# EAGLE design Oven Control (EAGLE 9.3.0)
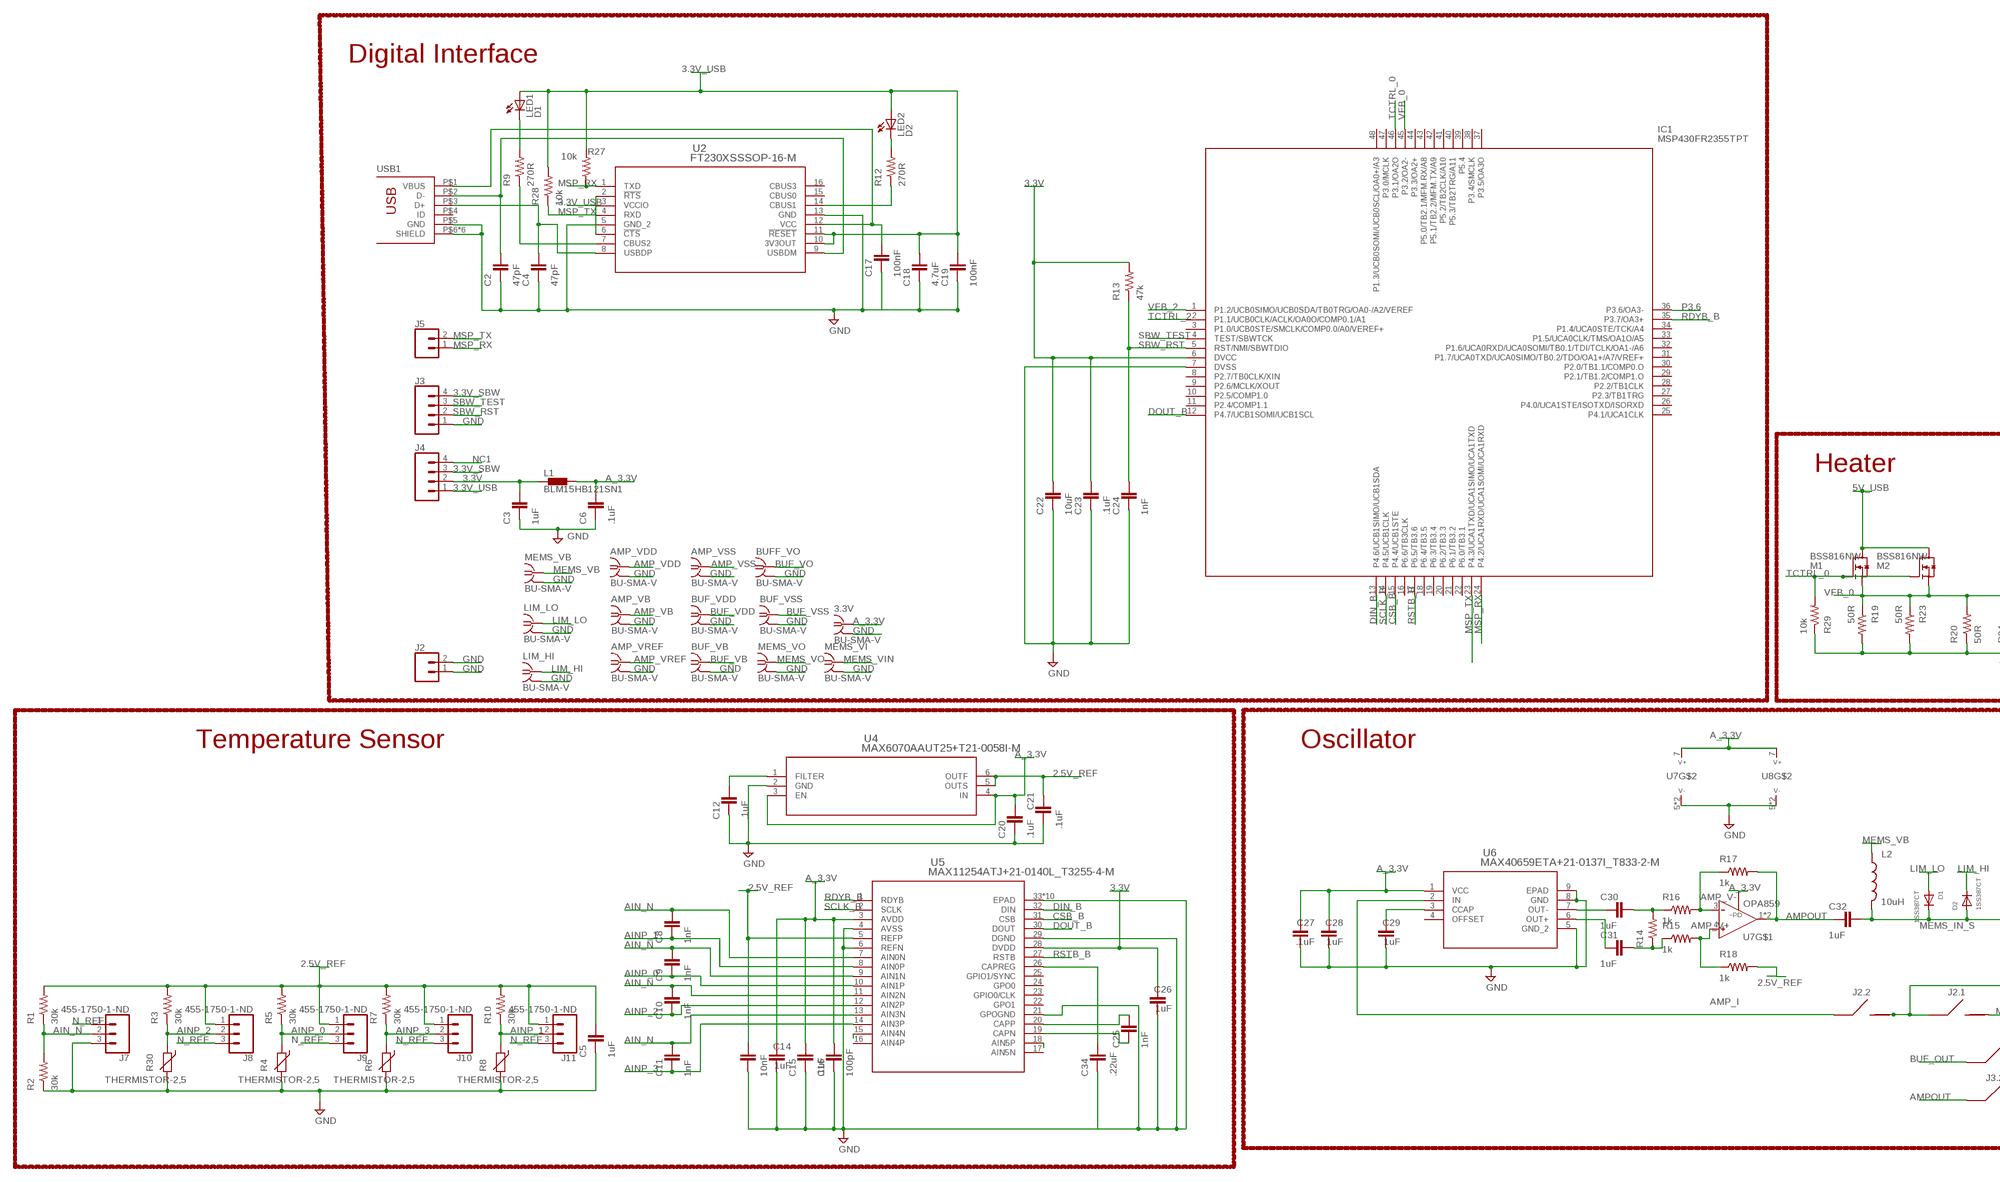
[diagram p0: schematic, sheet 1, part 1 of 2]
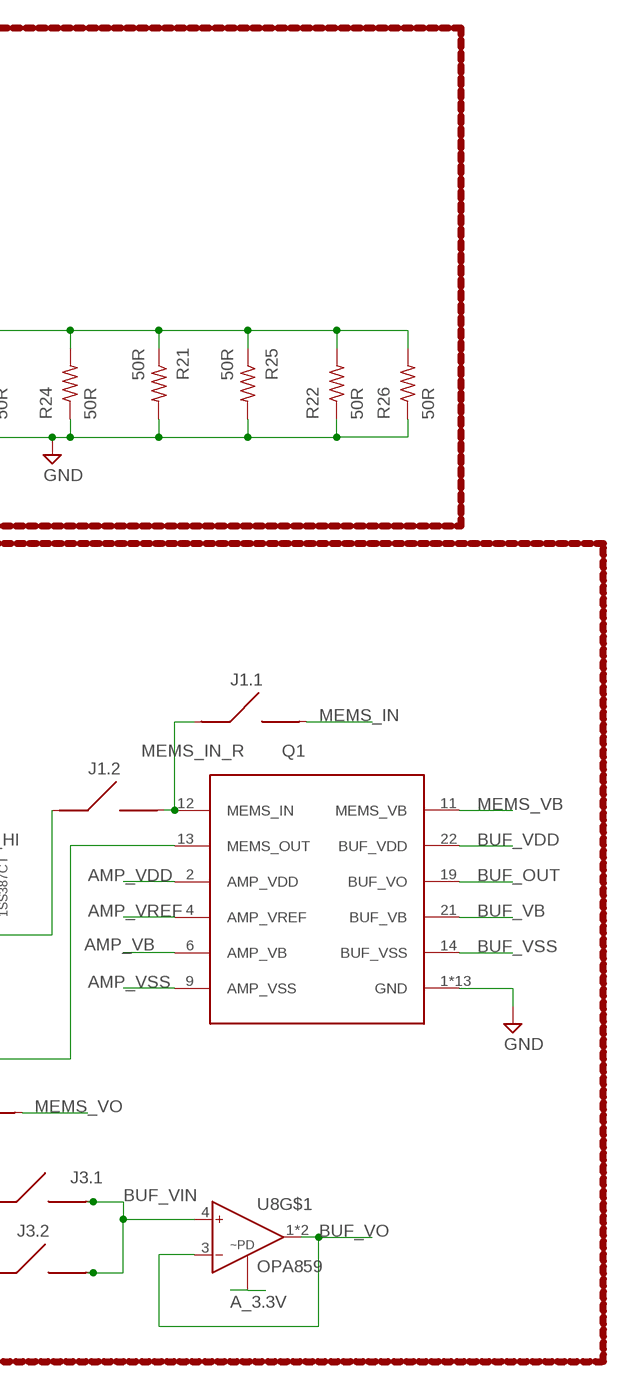
[diagram p1: schematic, sheet 1, part 2 of 2]

## Parts
3.3V  BU-SMA-V  [BU-SMA-V]
AMP_VB  BU-SMA-V  [BU-SMA-V]
AMP_VDD  BU-SMA-V  [BU-SMA-V]
AMP_VREF  BU-SMA-V  [BU-SMA-V]
AMP_VSS  BU-SMA-V  [BU-SMA-V]
BUF_VB  BU-SMA-V  [BU-SMA-V]
BUF_VDD  BU-SMA-V  [BU-SMA-V]
BUF_VSS  BU-SMA-V  [BU-SMA-V]
BUFF_VO  BU-SMA-V  [BU-SMA-V]
C2  47pF  CAP0402-CAP  [0402-CAP]
C3  1uF  CAP0402-CAP  [0402-CAP]
C4  47pF  CAP0402-CAP  [0402-CAP]
C5  1uF  CAP0402-CAP  [0402-CAP]
C6  .1uF  CAP0402-CAP  [0402-CAP]
C8  1nF  CAP0402-CAP  [0402-CAP]
C9  1nF  CAP0402-CAP  [0402-CAP]
C10  1nF  CAP0402-CAP  [0402-CAP]
C11  1nF  CAP0402-CAP  [0402-CAP]
C12  .1uF  CAP0402-CAP  [0402-CAP]
C13  10nF  CAP0402-CAP  [0402-CAP]
C14  1uF  CAP0402-CAP  [0402-CAP]
C15  .1uF  CAP0402-CAP  [0402-CAP]
C16  100pF  CAP0402-CAP  [0402-CAP]
C17  100nF  CAP0402-CAP  [0402-CAP]
C18  4.7uF  CAP0402-CAP  [0402-CAP]
C19  100nF  CAP0402-CAP  [0402-CAP]
C20  .1uF  CAP0402-CAP  [0402-CAP]
C21  .1uF  CAP0402-CAP  [0402-CAP]
C22  10uF  CAP0603-CAP  [0603-CAP]
C23  .1uF  CAP0402-CAP  [0402-CAP]
C24  1nF  CAP0402-CAP  [0402-CAP]
C25  1nF  CAP0402-CAP  [0402-CAP]
C26  1uF  CAP0402-CAP  [0402-CAP]
C27  .1uF  CAP0402-CAP  [0402-CAP]
C28  1uF  CAP0402-CAP  [0402-CAP]
C29  1uF  CAP0402-CAP  [0402-CAP]
C30  1uF  CAP0402-CAP  [0402-CAP]
C31  1uF  CAP0402-CAP  [0402-CAP]
C32  1uF  CAP0402-CAP  [0402-CAP]
C34  .22uF  CAP0402-CAP  [0402-CAP]
D1  1SS387CT  [SOD-882]
D2  1SS387CT  [SOD-882]
IC1  MSP430FR2355TPT  [QFP50P900X900X145-48N]
J1.1  0OHM_R  [R0402]
J1.2  0OHM_R  [R0402]
J2  CONN_02  [1X02]
J2.1  0OHM_R  [R0402]
J2.2  0OHM_R  [R0402]
J3  CONN_04  [1X04]
J3.1  0OHM_R  [R0402]
J3.2  0OHM_R  [R0402]
J4  CONN_04  [1X04]
J5  CONN_02  [1X02]
J7  455-1750-1-ND  CONN_03  [1X03]
J8  455-1750-1-ND  CONN_03  [1X03]
J9  455-1750-1-ND  CONN_03  [1X03]
J10  455-1750-1-ND  CONN_03  [1X03]
J11  455-1750-1-ND  CONN_03  [1X03]
L1  BLM15HB121SN1  [0402]
L2  10uH  INDUCTOR_0805  [R0805]
LED1  D1  LEDCHIPLED_0603  [CHIPLED_0603]
LED2  D2  LEDCHIPLED_0603  [CHIPLED_0603]
LIM_HI  BU-SMA-V  [BU-SMA-V]
LIM_LO  BU-SMA-V  [BU-SMA-V]
M1  BSS816NW  [SOT-323]
M2  BSS816NW  [SOT-323]
MEMS_VB  BU-SMA-V  [BU-SMA-V]
MEMS_VI  BU-SMA-V  [BU-SMA-V]
MEMS_VO  BU-SMA-V  [BU-SMA-V]
Q1  MEMS_RESONATOR  [DIL24]
R1  30k  R-US_R0603  [R0603]
R2  30k  R-US_R0603  [R0603]
R3  30k  R-US_R0603  [R0603]
R4  THERMISTOR-2,5  [RS-2,5]
R5  30k  R-US_R0603  [R0603]
R6  THERMISTOR-2,5  [RS-2,5]
R7  30k  R-US_R0603  [R0603]
R8  THERMISTOR-2,5  [RS-2,5]
R9  270R  R-US_R0603  [R0603]
R10  30k  R-US_R0603  [R0603]
R12  270R  R-US_R0603  [R0603]
R13  47k  R-US_R0603  [R0603]
R14  150R  R-US_R0402  [R0402]
R15  1k  R-US_R0402  [R0402]
R16  1k  R-US_R0402  [R0402]
R17  1k  R-US_R0402  [R0402]
R18  1k  R-US_R0402  [R0402]
R19  50R  R-US_R1206  [R1206]
R20  50R  R-US_R1206  [R1206]
R21  50R  R-US_R1206  [R1206]
R22  50R  R-US_R1206  [R1206]
R23  50R  R-US_R1206  [R1206]
R24  50R  R-US_R1206  [R1206]
R25  50R  R-US_R1206  [R1206]
R26  50R  R-US_R1206  [R1206]
R27  10k  R-US_R0402  [R0402]
R28  10k  R-US_R0402  [R0402]
R29  10k  R-US_R0402  [R0402]
R30  THERMISTOR-2,5  [RS-2,5]
U2  FT230XSSSOP-16-M  [SSOP-16-M]
U4  MAX6070AAUT25+T21-0058I-M  [21-0058I-M]
U5  MAX11254ATJ+21-0140L_T3255-4-M  [21-0140L_T3255-4-M]
U6  MAX40659ETA+21-0137I_T833-2-M  [21-0137I_T833-2-M]
U7  OPA859  [SON50P200X200X80-9N]
U8  OPA859  [SON50P200X200X80-9N]
USB1  USB-OTGMICRO-AB  [USB-MICRO-AB]

## Nets
2.5V_REF: C5.2 C13.2 C21.2 J8.1 J9.1 J10.1 J11.1 R1.2 R3.2 R5.2 R7.2 R10.2 R18.2 U4.5(OUTS) U4.6(OUTF) U5.5(REFP)
3.3V: C3.2 C22.2 C23.2 C26.2 IC1.6(DVCC) J4.2 L1.1 R13.2 U5.28(DVDD)
3.3V_SBW: J3.4 J4.3
3.3V_USB: C18.2 C19.2 J4.1 LED1.A LED2.A R27.2 R28.2 U2.3(VCCIO) U2.10(3V3OUT) U2.11(!RESET)
5V_USB: C17.2 M1.D M2.D U2.12(VCC) USB1.P$1(VBUS)
A_3.3V: 3.3V.1 C6.2 C14.2 C15.2 C16.2 C20.2 C27.2 C28.2 L1.2 U4.3(EN) U4.4(IN) U5.3(AVDD) U6.1(VCC) U7.7(V+) U7.8 U8.7(V+) U8.8
AIN_N: C8.2 C9.2 C10.2 C11.2 J7.2 R1.1 R2.2 U5.7(AIN0N) U5.9(AIN1N) U5.11(AIN2N) U5.13(AIN3N)
AINP_0: C9.1 J9.2 R4.1 R5.1 U5.10(AIN1P)
AINP_1: C8.1 J11.2 R8.1 R10.1 U5.8(AIN0P)
AINP_2: C10.1 J8.2 R3.1 R30.1 U5.12(AIN2P)
AINP_3: C11.1 J10.2 R6.1 R7.1 U5.14(AIN3P)
AMP_I: J2.2.1 U6.2(IN)
AMP_V+: R15.2 R18.1 U7.4(IN+)
AMP_V-: R16.2 R17.1 U7.3(IN-)
AMP_VB: AMP_VB.1 Q1.6(AMP_VB)
AMP_VDD: AMP_VDD.1 Q1.2(AMP_VDD)
AMP_VREF: AMP_VREF.1 Q1.4(AMP_VREF)
AMP_VSS: AMP_VSS.1 Q1.9(AMP_VSS)
AMPOUT: C32.1 J3.2.1 R17.2 U7.1(OUT) U7.6(OUT)
BUF_OUT: J3.1.1 Q1.19(BUF_VO)
BUF_VB: BUF_VB.1 Q1.21(BUF_VB)
BUF_VDD: BUF_VDD.1 Q1.22(BUF_VDD)
BUF_VIN: J3.1.2 J3.2.2 U8.4(IN+)
BUF_VO: BUFF_VO.1 U8.1(OUT) U8.3(IN-) U8.6(OUT)
BUF_VSS: BUF_VSS.1 Q1.14(BUF_VSS)
CSB_B: IC1.15(P4.4/UCB1STE) U5.31(CSB)
D+: C4.2 U2.8(USBDP) USB1.P$3(D+)
D-: C2.2 U2.9(USBDM) USB1.P$2(D-)
DIN_B: IC1.13(P4.6/UCB1SIMO/UCB1SDA) U5.32(DIN)
DOUT_B: IC1.12(P4.7/UCB1SOMI/UCB1SCL) U5.30(DOUT)
GND: 3.3V.2 3.3V.3 3.3V.4 3.3V.5 AMP_VB.2 AMP_VB.3 AMP_VB.4 AMP_VB.5 AMP_VDD.2 AMP_VDD.3 AMP_VDD.4 AMP_VDD.5 AMP_VREF.2 AMP_VREF.3 AMP_VREF.4 AMP_VREF.5 AMP_VSS.2 AMP_VSS.3 AMP_VSS.4 AMP_VSS.5 BUF_VB.2 BUF_VB.3 BUF_VB.4 BUF_VB.5 BUF_VDD.2 BUF_VDD.3 BUF_VDD.4 BUF_VDD.5 BUF_VSS.2 BUF_VSS.3 BUF_VSS.4 BUF_VSS.5 BUFF_VO.2 BUFF_VO.3 BUFF_VO.4 BUFF_VO.5 C2.1 C3.1 C4.1 C5.1 C6.1 C12.1 C13.1 C14.1 C15.1 C16.1 C17.1 C18.1 C19.1 C20.1 C21.1 C22.1 C23.1 C24.1 C26.1 C27.1 C28.1 C29.1 C34.1 IC1.7(DVSS) J2.1 J2.2 J3.1 J7.3 LIM_HI.2 LIM_HI.3 LIM_HI.4 LIM_HI.5 LIM_LO.2 LIM_LO.3 LIM_LO.4 LIM_LO.5 MEMS_VB.2 MEMS_VB.3 MEMS_VB.4 MEMS_VB.5 MEMS_VI.2 MEMS_VI.3 MEMS_VI.4 MEMS_VI.5 MEMS_VO.2 MEMS_VO.3 MEMS_VO.4 MEMS_VO.5 Q1.1(GND) Q1.3(GND) Q1.5(GND) Q1.7(GND) Q1.8(GND) Q1.10(GND) Q1.15(GND) Q1.16(GND) Q1.17(GND) Q1.18(GND) Q1.20(GND) Q1.23(GND) Q1.24(GND) R2.1 R4.2 R6.2 R8.2 R19.2 R20.1 R21.2 R22.1 R23.2 R24.1 R25.2 R26.1 R29.1 R30.2 U2.5(GND_2) U2.13(GND) U4.2(GND) U5.4(AVSS) U5.6(REFN) U5.21(GPOGND) U5.29(DGND) U5.33(EPAD) U5.P$1(EPAD) U5.P$2(EPAD) U5.P$3(EPAD) U5.P$4(EPAD) U5.P$5(EPAD) U5.P$6(EPAD) U5.P$7(EPAD) U5.P$8(EPAD) U5.P$9(EPAD) U6.5(GND_2) U6.8(GND) U6.9(EPAD) U7.5(V-) U7.9(V-) U8.5(V-) U8.9(V-) USB1.P$5(GND) USB1.P$6(SHIELD) USB1.P$7(SHIELD) USB1.P$8(SHIELD) USB1.P$9(SHIELD) USB1.P$10(SHIELD) USB1.P$11(SHIELD)
LIM_HI: D2.C LIM_HI.1
LIM_LO: D1.A LIM_LO.1
MEMS_IN: J1.1.2
MEMS_IN_R: J1.1.1 J1.2.2 Q1.12(MEMS_IN)
MEMS_IN_S: C32.2 D1.C D2.A J1.2.1 L2.2
MEMS_OUT: J2.1.1 J2.2.2 Q1.13(MEMS_OUT)
MEMS_VB: L2.1 MEMS_VB.1 Q1.11(MEMS_VB)
MEMS_VIN: MEMS_VI.1
MEMS_VO: J2.1.2 MEMS_VO.1
MSP_RX: IC1.24(P4.2/UCA1RXD/UCA1SOMI/UCA1RXD) J5.1 R27.1 U2.1(TXD)
MSP_TX: IC1.23(P4.3/UCA1TXD/UCA1SIMO/UCA1TXD) J5.2 R28.1 U2.4(RXD)
N$1: C25.2 U5.20(CAPP)
N$2: C25.1 U5.19(CAPN)
N$3: C31.2 R14.1 R15.1
N$4: C29.2 U6.3(CCAP)
N$5: U5.17(AIN5N)
N$6: C12.2 U4.1(FILTER)
N$7: C30.2 R14.2 R16.1
N$8: U5.16(AIN4P)
N$10: C34.2 U5.26(CAPREG)
N$12: C30.1 U6.7(OUT-)
N$13: C31.1 U6.6(OUT+)
N$15: U2.2(!RTS) U2.6(!CTS)
N$20: LED2.C R12.2
N$21: LED1.C R9.2
N$34: U5.18(AIN5P)
N$35: U5.15(AIN4N)
N_REF: J7.1 J8.3 J9.3 J10.3 J11.3
NC1: J4.4
P3.6: IC1.36(P3.6/OA3-)
RDYB_B: IC1.35(P3.7/OA3+) U5.1(RDYB)
RSTB_B: IC1.17(P6.5/TB3.6) U5.27(RSTB)
RX#1: R12.1 U2.14(CBUS1)
SBW_RST: C24.2 IC1.5(RST/NMI/SBWTDIO) J3.2 R13.1
SBW_TEST: IC1.4(TEST/SBWTCK) J3.3
SCLK_B: IC1.14(P4.5/UCB1CLK) U5.2(SCLK)
TCTRL_0: IC1.46(P3.1/OA2O) M1.G M2.G R29.2
TCTRL_2: IC1.2(P1.1/UCB0CLK/ACLK/OA0O/COMP0.1/A1)
TX#1: R9.1 U2.7(CBUS2)
VFB_0: IC1.45(P3.2/OA2-) M1.S M2.S R19.1 R20.2 R21.1 R22.2 R23.1 R24.2 R25.1 R26.2
VFB_2: IC1.1(P1.2/UCB0SIMO/UCB0SDA/TB0TRG/OA0-/A2/VEREF)
Unconnected: IC1.3(P1.0/UCB0STE/SMCLK/COMP0.0/A0/VEREF+) IC1.8(P2.7/TB0CLK/XIN) IC1.9(P2.6/MCLK/XOUT) IC1.10(P2.5/COMP1.0) IC1.11(P2.4/COMP1.1) IC1.16(P6.6/TB3CLK) IC1.18(P6.4/TB3.5) IC1.19(P6.3/TB3.4) IC1.20(P6.2/TB3.3) IC1.21(P6.1/TB3.2) IC1.22(P6.0/TB3.1) IC1.25(P4.1/UCA1CLK) IC1.26(P4.0/UCA1STE/ISOTXD/ISORXD) IC1.27(P2.3/TB1TRG) IC1.28(P2.2/TB1CLK) IC1.29(P2.1/TB1.2/COMP1.O) IC1.30(P2.0/TB1.1/COMP0.O) IC1.31(P1.7/UCA0TXD/UCA0SIMO/TB0.2/TDO/OA1+/A7/VREF+) IC1.32(P1.6/UCA0RXD/UCA0SOMI/TB0.1/TDI/TCLK/OA1-/A6) IC1.33(P1.5/UCA0CLK/TMS/OA1O/A5) IC1.34(P1.4/UCA0STE/TCK/A4) IC1.37(P3.5/OA3O) IC1.38(P3.4/SMCLK) IC1.39(P5.4) IC1.40(P5.3/TB2TRG/A11) IC1.41(P5.2/TB2CLK/A10) IC1.42(P5.1/TB2.2/MFM.TX/A9) IC1.43(P5.0/TB2.1/MFM.RX/A8) IC1.44(P3.3/OA2+) IC1.47(P3.0/MCLK) IC1.48(P1.3/UCB0SOMI/UCB0SCL/OA0+/A3) U2.15(CBUS0) U2.16(CBUS3) U5.22(GPO1) U5.23(GPIO0/CLK) U5.24(GPO0) U5.25(GPIO1/SYNC) U6.4(OFFSET) USB1.P$4(ID)

## Notes on the sheet
- Digital Interface
- Heater
- Temperature Sensor | Oscillator

## Library data of the parts
3.3V AMP_VB AMP_VDD AMP_VREF AMP_VSS BUF_VB BUF_VDD BUF_VSS BUFF_VO LIM_HI LIM_LO MEMS_VB MEMS_VI MEMS_VO = con-coax:BU-SMA-V: FEMALE SMA CONNECTOR Radiall distributor RS 112-3794; OC_FARNELL: unknown; OC_NEWARK: unknown
C2-C6 C8-C32 C34 = pie:CAP: Capacitor Standard 0603 ceramic capacitor, and 0.1" leaded capacitor.; PIE-INT-REF-NUM: CAPACITOR-GENERIC
D1 D2 = Oven Control Lib:1SS387CT; PART_NO: 1SS387CT
IC1 = Oven Control Lib:MSP430FR2355TPT: 16-bit Microcontrollers - MCU 24MHz 105C ULP Microcontroller With 32 KB FRAM, 4 KB SRAM, 44 IO, 12-bit ADC, 12-bit DACs, OpAmp/PGA 48-LQFP -40 to 105 Source: Datasheet <https://www.arrow.com/en/products/msp430fr2355tpt/texas-instruments>; DESCRIPTION: 16-bit Microcontrollers - MCU 24MHz 105C ULP Microcontroller With 32 KB FRAM, 4 KB SRAM, 44 IO, 12-bit ADC, 12-bit DACs, OpAmp/PGA 48-LQFP -40 to 105; HEIGHT: 1.45mm; MANUFACTURER_NAME: Texas Instruments; MANUFACTURER_PART_NUMBER: MSP430FR2355TPT
J1.1 J1.2 J2.1 J2.2 J3.1 J3.2 = Oven Control Lib:0OHM_R
J2 J5 = SparkFun-Connectors:CONN_02: Multi connection point. Often used as Generic Header-pin footprint for 0.1 inch spaced/style header connections On any of the 0.1 inch spaced packages, you can populate with these: Break Away Headers - Straight <https://www.sparkfun.com/products/116> (PRT-00116) Break Away Male Headers - Right Angle <https://www.sparkfun.com/products/553> (PRT-00553) Female Headers <https://www.sparkfun.com/products/115> (PRT-00115) Break Away Headers - Machine Pin <https://www.sparkfun.com/products/117> (PRT-00117) Break Away Female Headers - Swiss Machine Pin <https://www.sparkfun.com/products/743> (PRT-00743) For SCREWTERMINALS and SPRING TERMINALS visit here: Screw Terimnals on SparkFun.com <https://www.sparkfun.com/search/results?term=Screw+Terminals> (5mm/3.5mm/2.54mm spacing) This device is also useful as a general connection point to wire up your design to another part of your project. Our various solder wires solder well into these plated through hole pads. Hook-Up Wire - Assortment (Stranded, 22 AWG) <https://www.sparkfun.com/products/11375> (PRT-11375) Hook-Up Wire - Assortment (Solid Core, 22 AWG) <https://www.sparkfun.com/products/11367> (PRT-11367) View the entire wire category on our website here <https://www.sparkfun.com/categories/141> Special notes: Molex polarized connector foot print use with: PRT-08233 with associated crimp pins and housings. 2.54_SCREWTERM for use with PRT-10571. 3.5mm Screw Terminal footprints for PRT-08084 5mm Screw Terminal footprints for use with PRT-08432
J3 J4 = SparkFun-Connectors:CONN_04: Multi connection point. Often used as Generic Header-pin footprint for 0.1 inch spaced/style header connections On any of the 0.1 inch spaced packages, you can populate with these: Break Away Headers - Straight <https://www.sparkfun.com/products/116> (PRT-00116) Break Away Male Headers - Right Angle <https://www.sparkfun.com/products/553> (PRT-00553) Female Headers <https://www.sparkfun.com/products/115> (PRT-00115) Break Away Headers - Machine Pin <https://www.sparkfun.com/products/117> (PRT-00117) Break Away Female Headers - Swiss Machine Pin <https://www.sparkfun.com/products/743> (PRT-00743) For SCREWTERMINALS and SPRING TERMINALS visit here: Screw Terimnals on SparkFun.com <https://www.sparkfun.com/search/results?term=Screw+Terminals> (5mm/3.5mm/2.54mm spacing) This device is also useful as a general connection point to wire up your design to another part of your project. Our various solder wires solder well into these plated through hole pads. Hook-Up Wire - Assortment (Stranded, 22 AWG) <https://www.sparkfun.com/products/11375> (PRT-11375) Hook-Up Wire - Assortment (Solid Core, 22 AWG) <https://www.sparkfun.com/products/11367> (PRT-11367) View the entire wire category on our website here <https://www.sparkfun.com/categories/141> Special notes: Molex polarized connector foot print use with SKU : PRT-08231 with associated crimp pins and housings. 1MM SMD Version SKU: PRT-10208; PROD_ID: CONN-09696
J7-J11 = SparkFun-Connectors:CONN_03: Multi connection point. Often used as Generic Header-pin footprint for 0.1 inch spaced/style header connections On any of the 0.1 inch spaced packages, you can populate with these: Break Away Headers - Straight <https://www.sparkfun.com/products/116> (PRT-00116) Break Away Male Headers - Right Angle <https://www.sparkfun.com/products/553> (PRT-00553) Female Headers <https://www.sparkfun.com/products/115> (PRT-00115) Break Away Headers - Machine Pin <https://www.sparkfun.com/products/117> (PRT-00117) Break Away Female Headers - Swiss Machine Pin <https://www.sparkfun.com/products/743> (PRT-00743) Stackable Header - 3 Pin (Female, 0.1") <https://www.sparkfun.com/products/13875> (PRT-13875) For SCREWTERMINALS and SPRING TERMINALS visit here: Screw Terimnals on SparkFun.com <https://www.sparkfun.com/search/results?term=Screw+Terminals> (5mm/3.5mm/2.54mm spacing) This device is also useful as a general connection point to wire up your design to another part of your project. Our various solder wires solder well into these plated through hole pads. Hook-Up Wire - Assortment (Stranded, 22 AWG) <https://www.sparkfun.com/products/11375> (PRT-11375) Hook-Up Wire - Assortment (Solid Core, 22 AWG) <https://www.sparkfun.com/products/11367> (PRT-11367) View the entire wire category on our website here <https://www.sparkfun.com/categories/141> Special notes: Molex polarized connector foot print use with SKU : PRT-08232 with associated crimp pins and housings.; PROD_ID: XXX-00000
L1 = inductors:BLM15H: EMIFIL (R) Chip Ferrite Bead for GHz Noise Source: http://www.murata.com/ Ferrite Bead BLM15H.pdf
L2 = Oven Control Lib:INDUCTOR_0805
LED1 LED2 = adafruit:LED: LED OSRAM: - CHIPLED LG R971, LG N971, LY N971, LG Q971, LY Q971, LO R971, LY R971 LH N974, LH R974 LS Q976, LO Q976, LY Q976 LO Q996 - Hyper CHIPLED LW Q18S LB Q993, LB Q99A, LB R99A - SideLED LS A670, LO A670, LY A670, LG A670, LP A670 LB A673, LV A673, LT A673, LW A673 LH A674 LY A675 LS A676, LA A676, LO A676, LY A676, LW A676 LS A679, LY A679, LG A679 - Hyper Micro SIDELED® LS Y876, LA Y876, LO Y876, LY Y876 LT Y87S - SmartLED LW L88C, LW L88S LB L89C, LB L89S, LG L890 LS L89K, LO L89K, LY L89K LS L896, LA L896, LO L896, LY L896 - TOPLED LS T670, LO T670, LY T670, LG T670, LP T670 LSG T670, LSP T670, LSY T670, LOP T670, LYG T670 LG T671, LOG T671, LSG T671 LB T673, LV T673, LT T673, LW T673 LH T674 LS T676, LA T676, LO T676, LY T676, LB T676, LH T676, LSB T676, LW T676 LB T67C, LV T67C, LT T67C, LS T67K, LO T67K, LY T67K, LW E67C LS E67B, LA E67B, LO E67B, LY E67B, LB E67C, LV E67C, LT E67C LW T67C LS T679, LY T679, LG T679 LS T770, LO T770, LY T770, LG T770, LP T770 LB T773, LV T773, LT T773, LW T773 LH T774 LS E675, LA E675, LY E675, LS T675 LS T776, LA T776, LO T776, LY T776, LB T776 LHGB T686 LT T68C, LB T68C - Hyper Mini TOPLED® LB M676 - Mini TOPLED Santana® LG M470 LS M47K, LO M47K, LY M47K Source: http://www.osram.convergy.de/
M1 M2 = Oven Control Lib:BSS816NW
Q1 = Oven Control Lib:MEMS_RESONATOR
R1-R3 R5 R7 R9 R10 R12 R13 = pie:R-US_: RESISTOR, American symbol; DESCRIPTION: RESISTOR, American symbol; DISTRIBUTOR: DigiKey; MANUFACTURER: Rohm Semiconductor; NOTES: Cut Tape; PACKAGE: R0603; VALUE: >VALUE
R4 R6 R8 R30 = varistor:THERMISTOR: THERMISTOR; PART_NO: NXRT15WB473FA1B030
R14-R29 = pie:R-US_: RESISTOR, American symbol; PIE-INT-REF-NUM: RESISTOR-GENERIC
U2 = Oven Control Lib:FT230XS; MANUFACTURER_PART_NUMBER: FT230XS; VENDOR: FTDI Future Technology Devices International Ltd
U4 = Oven Control Lib:MAX6070AAUT25+T; MANUFACTURER_PART_NUMBER: MAX6070AAUT25+T; VENDOR: Maxim Integrated Products
U5 = Oven Control Lib:MAX11254ATJ+; MANUFACTURER_PART_NUMBER: MAX11254ATJ+; VENDOR: Maxim Integrated Products
U6 = Oven Control Lib:MAX40659ETA+; MANUFACTURER_PART_NUMBER: MAX40659ETA+; VENDOR: Maxim Integrated Products
U7 = Oven Control Lib:OPA859; SPICEPREFIX: E
U8 = Oven Control Lib:OPA859
USB1 = pie:USB-OTG: USB Connector OTG connector with ID pin; PIE-DIGIKEY-PN-PRI: H11635CT-ND; PIE-INT-REF-NUM: USB

## Board
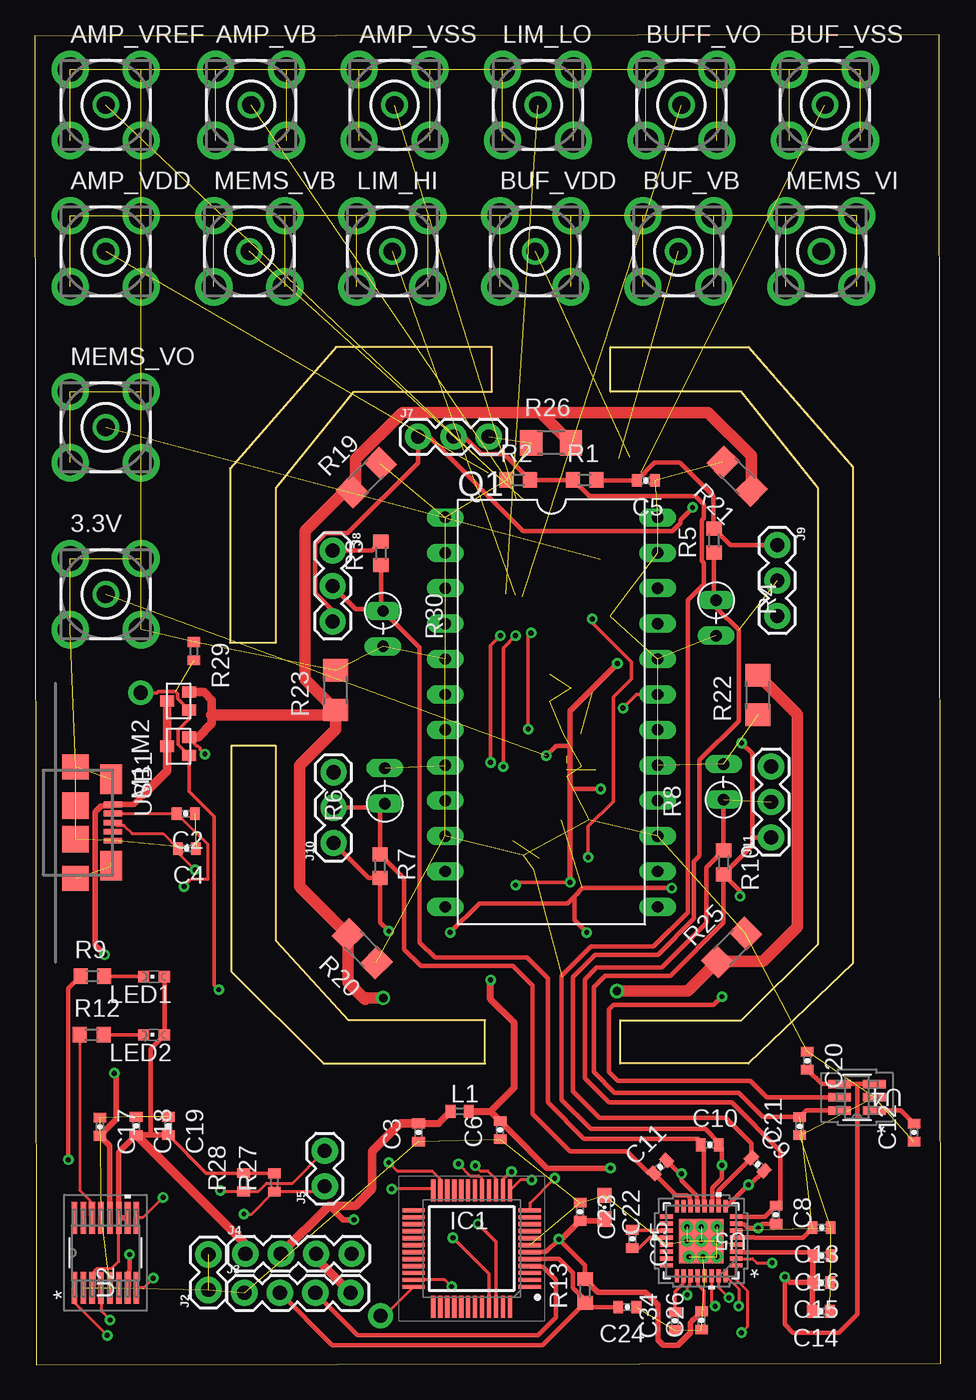
[diagram p2: board, top side]
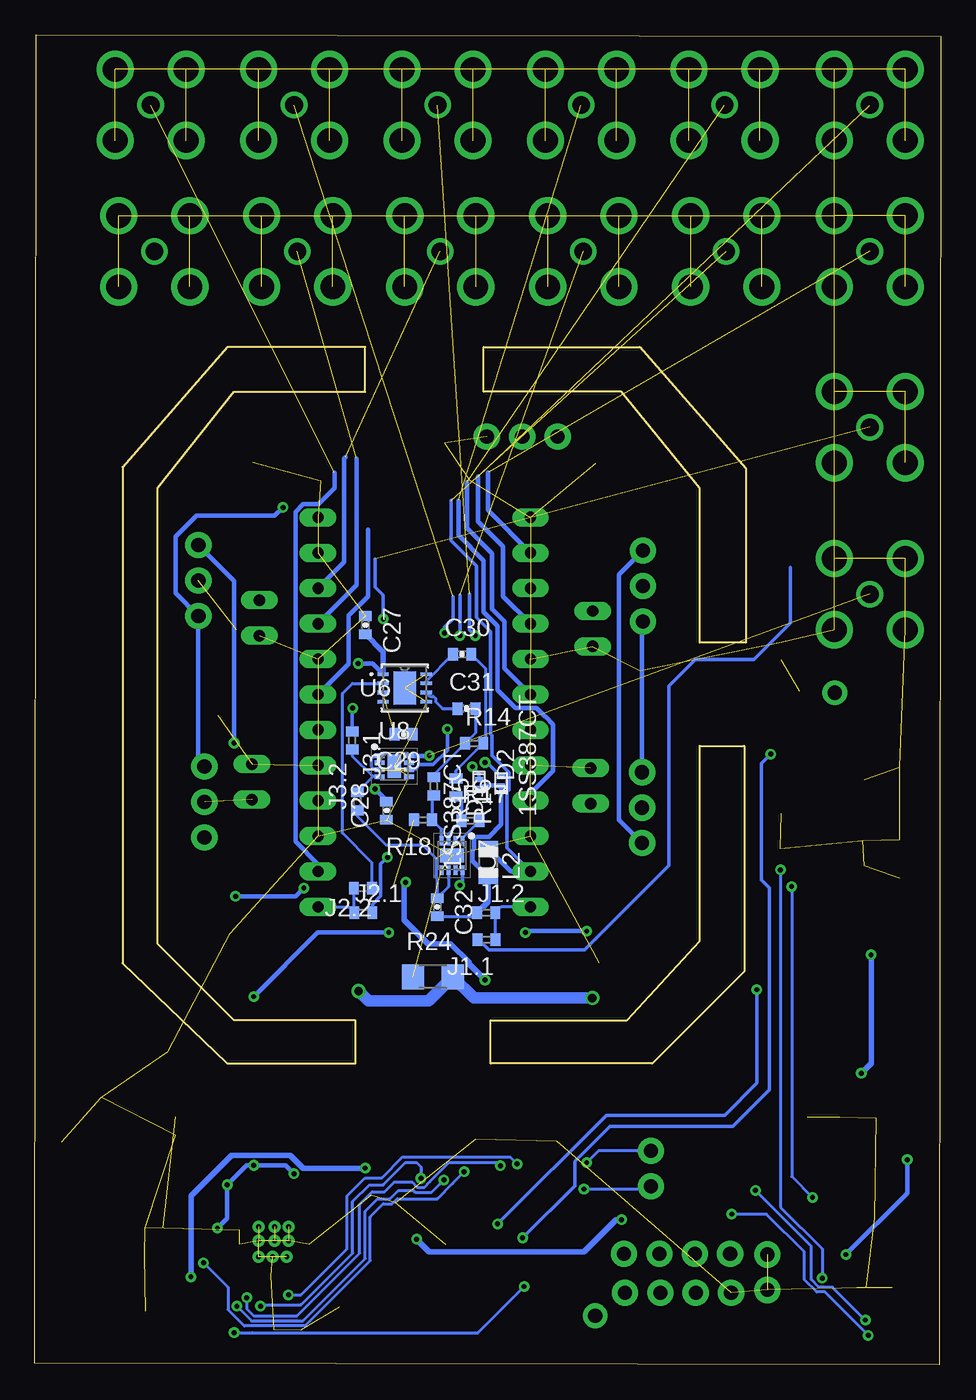
[diagram p3: board, bottom side, seen from below]

Size 65 x 95.4 mm. Coordinates in mm from the lower left corner, seen from the top.
Outline: 0.1,0 65,0.1 64.9,95.4 0,95.3 0.1,0
Outline: 20.7,21.6 32.3,21.6 32.3,24.7 22.5,24.7 17.3,30.4 17.3,44.4 14.1,44.4 14.1,28.2 20.7,21.6
Outline: 17.3,62.9 22.9,69.8 32.8,69.8 32.8,73 21.6,73 14,64.3 14,51.8 17.3,51.8 17.3,62.9
Outline: 51.2,21.6 42,21.6 42,24.7 50.7,24.7 56.2,30.2 56.2,62.9 50.7,69.8 41.3,69.8 41.3,73 51.2,73 58.7,64.4 58.7,28.8 51.2,21.6
Copper layers (1*16): Top 0.035mm / dielectric 1.5mm / Bottom 0.035mm
Design rules "default": minimum track width 6mil, minimum drill 0.35mm, track to track 6mil, track to pad 6mil, pad to pad 6mil, via to via 6mil, smd to smd 6mil, copper to edge 40mil, drill to drill 6mil, minimum pad ring 10mil, minimum via ring 8mil, stop-mask expansion 4mil, vias tented up to drill 0mil, thermal gap 10mil

### Footprints (pad centres in the part's own frame; a part is rotated, then mirrored left to right if it is on the bottom)
BU-SMA-V = drill 1.27: 1 0,0 | drill 1.778: 2 -2.55,2.55; 3 2.55,2.55; 4 2.55,-2.55; 5 -2.55,-2.55
0402-CAP = smd 0.7 x 0.9: 1 -0.65,0; 2 0.65,0
0603-CAP = smd 1.1 x 1: 1 -0.85,0; 2 0.85,0
SOD-882 = smd 0.35 x 0.6: A 0.325,0; C -0.325,0
QFP50P900X900X145-48N = smd 1.6 x 0.3: 1 -4.175,2.75; 2 -4.175,2.25; 3 -4.175,1.75; 4 -4.175,1.25; 5 -4.175,0.75; 6 -4.175,0.25; 7 -4.175,-0.25; 8 -4.175,-0.75; 9 -4.175,-1.25; 10 -4.175,-1.75; 11 -4.175,-2.25; 12 -4.175,-2.75; 25 4.175,-2.75; 26 4.175,-2.25; 27 4.175,-1.75; 28 4.175,-1.25; 29 4.175,-0.75; 30 4.175,-0.25; 31 4.175,0.25; 32 4.175,0.75; 33 4.175,1.25; 34 4.175,1.75; 35 4.175,2.25; 36 4.175,2.75 | smd 0.3 x 1.6: 13 -2.75,-4.175; 14 -2.25,-4.175; 15 -1.75,-4.175; 16 -1.25,-4.175; 17 -0.75,-4.175; 18 -0.25,-4.175; 19 0.25,-4.175; 20 0.75,-4.175; 21 1.25,-4.175; 22 1.75,-4.175; 23 2.25,-4.175; 24 2.75,-4.175; 37 2.75,4.175; 38 2.25,4.175; 39 1.75,4.175; 40 1.25,4.175; 41 0.75,4.175; 42 0.25,4.175; 43 -0.25,4.175; 44 -0.75,4.175; 45 -1.25,4.175; 46 -1.75,4.175; 47 -2.25,4.175; 48 -2.75,4.175
R0402 = smd 0.7 x 0.9: 1 -0.65,0; 2 0.65,0
1X02 = drill 1.016 pad 1.88: 1 0,0; 2 2.54,0
1X04 = drill 1.016 pad 1.88: 1 0,0; 2 2.54,0; 3 5.08,0; 4 7.62,0
1X03 = drill 1.016 pad 1.88: 1 0,0; 2 2.54,0; 3 5.08,0
0402 = smd 0.7 x 0.9: 1 -0.65,0; 2 0.65,0
R0805 = smd 1.1 x 1.4: 1 -1,0; 2 1,0
CHIPLED_0603 = smd 0.8 x 0.8: A 0,-0.75; C 0,0.75
SOT-323 = smd 0.8 x 1: D 0,0; G -0.65,-1.6; S 0.65,-1.6
DIL24 = drill 0.813 long: 1 -13.97,-7.62; 2 -11.43,-7.62; 3 -8.89,-7.62; 4 -6.35,-7.62; 5 -3.81,-7.62; 6 -1.27,-7.62; 7 1.27,-7.62; 8 3.81,-7.62; 9 6.35,-7.62; 10 8.89,-7.62; 11 11.43,-7.62; 12 13.97,-7.62; 13 13.97,7.62; 14 11.43,7.62; 15 8.89,7.62; 16 6.35,7.62; 17 3.81,7.62; 18 1.27,7.62; 19 -1.27,7.62; 20 -3.81,7.62; 21 -6.35,7.62; 22 -8.89,7.62; 23 -11.43,7.62; 24 -13.97,7.62
R0603 = smd 1 x 1.1: 1 -0.85,0; 2 0.85,0
RS-2,5 = drill 0.813 long: 1 -1.27,0; 2 1.27,0
R1206 = smd 1.6 x 1.803: 1 -1.422,0; 2 1.422,0
SSOP-16-M = smd 2.286 x 0.406: 1 -2.515,2.223; 2 -2.515,1.587; 3 -2.515,0.953; 4 -2.515,0.318; 5 -2.515,-0.318; 6 -2.515,-0.953; 7 -2.515,-1.587; 8 -2.515,-2.223; 9 2.515,-2.223; 10 2.515,-1.587; 11 2.515,-0.953; 12 2.515,-0.318; 13 2.515,0.318; 14 2.515,0.953; 15 2.515,1.587; 16 2.515,2.223
21-0058I-M = smd 1.626 x 0.61: 1 -1.245,0.95; 2 -1.245,0; 3 -1.245,-0.95; 4 1.245,-0.95; 5 1.245,0; 6 1.245,0.95
21-0140L_T3255-4-M = smd 0.914 x 0.305: 1 -2.502,1.75; 2 -2.502,1.25; 3 -2.502,0.75; 4 -2.502,0.25; 5 -2.502,-0.25; 6 -2.502,-0.75; 7 -2.502,-1.25; 8 -2.502,-1.75; 17 2.502,-1.75; 18 2.502,-1.25; 19 2.502,-0.75; 20 2.502,-0.25; 21 2.502,0.25; 22 2.502,0.75; 23 2.502,1.25; 24 2.502,1.75 | smd 0.305 x 0.914: 9 -1.75,-2.502; 10 -1.25,-2.502; 11 -0.75,-2.502; 12 -0.25,-2.502; 13 0.25,-2.502; 14 0.75,-2.502; 15 1.25,-2.502; 16 1.75,-2.502; 25 1.75,2.502; 26 1.25,2.502; 27 0.75,2.502; 28 0.25,2.502; 29 -0.25,2.502; 30 -0.75,2.502; 31 -1.25,2.502; 32 -1.75,2.502 | smd 3.2 x 3.2: 33 0,0 | drill 0.35: P$1 -1.143,1.143; P$2 -0.127,1.143; P$3 0.889,1.143; P$4 0,0; P$5 1.016,0; P$6 -1.143,0; P$7 -1.143,-1.016; P$8 0,-1.016; P$9 1.016,-1.016
21-0137I_T833-2-M = smd 0.806 x 0.254: 1 -1.553,0.991; 2 -1.553,0.33; 3 -1.553,-0.33; 4 -1.553,-0.991; 5 1.553,-0.991; 6 1.553,-0.33; 7 1.553,0.33; 8 1.553,0.991 | smd 1.6 x 2.388: 9 0,0
SON50P200X200X80-9N = smd 0.7 x 0.3: 1 -1.05,0.75; 2 -1.05,0.25; 3 -1.05,-0.25; 4 -1.05,-0.75; 5 1.05,-0.75; 6 1.05,-0.25; 7 1.05,0.25; 8 1.05,0.75 | smd 1 x 1.7: 9 0,0
USB-MICRO-AB = smd 0.4 x 1.35: P$1 -1.3,1; P$2 -0.65,1; P$3 0,1; P$4 0.65,1; P$5 1.3,1 | smd 2.1 x 1.6: P$6 -3.1,0.875; P$7 3.1,0.875 | smd 1.8 x 1.9: P$8 -4,-1.675; P$9 4,-1.675 | smd 1.9 x 1.9: P$10 -1.2,-1.675; P$11 1.2,-1.675

### Placement (x,y rotation side)
3.3V  5.09,55.27 0 top
AMP_VB  15.51,90.37 0 top
AMP_VDD  5.09,79.87 0 top
AMP_VREF  5.09,90.37 0 top
AMP_VSS  25.81,90.37 0 top
BUF_VB  46.17,79.87 0 top
BUF_VDD  35.91,79.87 0 top
BUF_VSS  56.69,90.37 0 top
BUFF_VO  46.4,90.37 0 top
C2  10.83,39.53 180 top
C3  27.53,16.66 90 top
C4  10.91,37.03 180 top
C5  43.85,63.43 180 top
C6  33.38,16.83 90 top
C8  53.17,10.76 270 top
C9  51.87,14.37 315 top
C10  48.42,15.77 0 top
C11  44.87,14.19 45 top
C12  63.08,16.65 90 top
C13  56.45,9.83 180 top
C14  56.4,3.83 180 top
C15  56.43,5.88 180 top
C16  56.47,7.83 180 top
C17  4.67,17.07 270 top
C18  7.27,17.12 270 top
C19  9.57,17.12 270 top
C20  55.42,21.81 270 top
C21  54.88,17.11 90 top
C22  40.87,11.3 270 top
C23  39.12,10.97 270 top
C24  42.51,4.13 180 top
C25  42.87,9.02 270 top
C26  47.83,3.17 90 top
C27  41.28,53.05 270 bottom
C28  39.77,39.74 90 bottom
C29  38.55,45.23 180 bottom
C30  34.34,50.97 0 bottom
C31  34.03,47.07 0 bottom
C32  36.13,32.82 270 bottom
C34  45.93,3.13 90 top
D1  31.55,41.86 90 bottom
D2  33.13,41.65 270 bottom
IC1  31.34,8.33 180 top
J1.1  32.59,30.48 180 bottom
J1.2  32.62,32.42 0 bottom
J2  12.45,5.36 90 top
J2.1  41.43,32.42 0 bottom
J2.2  41.46,34.18 180 bottom
J3  15.04,5.15 0 top
J3.1  42.23,44.78 270 bottom
J3.2  41.87,40.41 90 bottom
J4  15.11,7.95 0 top
J5  20.8,12.8 90 top
J7  27.49,66.57 0 top
J8  21.37,58.4 270 top
J9  53.27,58.79 270 top
J10  21.43,37.42 90 top
J11  52.83,37.83 90 top
L1  30.48,18.17 0 top
L2  32.48,36.02 270 bottom
LED1  8.55,27.84 90 top
LED2  8.55,23.66 90 top
LIM_HI  25.65,79.87 0 top
LIM_LO  36.1,90.37 0 top
M1  9.48,44.36 90 top
M2  9.48,47.61 90 top
MEMS_VB  15.39,79.87 0 top
MEMS_VI  56.43,79.87 0 top
MEMS_VO  5.09,67.25 0 top
Q1  37.06,46.81 270 top
R1  39.46,63.47 0 top
R2  34.68,63.47 0 top
R3  24.83,58.2 90 top
R4  48.88,53.57 270 top
R5  48.73,59.12 90 top
R6  25.12,41.52 90 top
R7  24.77,35.76 270 top
R8  49.42,41.81 90 top
R9  4.13,27.87 0 top
R10  49.42,36.03 270 top
R12  4.08,23.67 0 top
R13  39.48,5.29 90 top
R14  33.48,44.57 0 bottom
R15  36.38,41.49 270 bottom
R16  34.78,41.41 270 bottom
R17  33.73,39.02 0 bottom
R18  37.15,39.08 180 bottom
R19  23.77,63.64 45 top
R20  23.49,29.83 135 top
R21  50.39,63.73 135 top
R22  51.87,48.04 90 top
R23  21.57,48.39 90 top
R24  36.44,27.83 0 bottom
R25  49.99,29.93 45 top
R26  37.04,66.13 0 top
R27  17.18,13.07 90 top
R28  14.98,13.09 90 top
R29  11.42,51.19 270 top
R30  24.98,52.8 270 top
U2  5.07,8.02 90 top
U4  58.99,19.18 180 top
U5  47.81,8.87 180 top
U6  38.46,48.55 0 bottom
U7  35.07,36.53 270 bottom
U8  39.21,42.93 0 bottom
USB1  4.6,38.89 270 top

### Tracks (layer width: path | path; a pad name or v marks a point on that pad's centre or on a via)
2.5V_REF  (via drill 0.35)  (2 unrouted)
  Top 0.305: U4.6 55.35,18.23 C21.2 52.24,17.76 50.5,19.5 41.6,19.5 40.1,21 40.1,27.1 40.9,27.9 45.6,27.9 49.42,31.72 R10.2 | R10.2 51.47,37.23 51.47,37.83 | 51.47,37.83 J11.1 | 51.47,37.83 51.47,43.83 v50.7,44.6 | J9.1 49.91,58.79 R5.2 48.7,60 48.7,62.3 46.3,64.7 44.47,64.7 C5.2 40.35,63.43 R1.2 | R10.2 50.6,34 v50.6,33.6 | v45.7,34.19 39.29,34.19 38.7,33.6 | 38.7,33.6 38.2,33.1 31.9,33.1 v29.8,31 | v25.4,31.1 24.77,31.73 R7.2 23.94,34.91 J10.1 | U4.5 52.52,19.18 51.35,20.35 41.85,20.35 41.2,21 41.2,25.5 41.5,25.8 48.7,25.8 v49.3,26.4 | v39.6,31 38.7,31.9 38.7,33.6 | J8.1 24.18,58.4 R3.2 | U5.5 51.61,9.12 51.62,9.12 55.09,9.12 C13.2
  Bottom 0.305: v50.7,44.6 50.7,56.22 J9.1 | v50.6,33.6 46.29,33.6 v45.7,34.19 | v29.8,31 29.7,31.1 v25.4,31.1 | v49.3,26.4 44.7,31 v39.6,31 | J10.1 23.1,39.09 23.1,56.67 J8.1
3.3V  (via drill 0.35)
  Top 0.254: U5.28 47.56,5.74 48,5.3 48,3.99 C26.2
  Top 0.305: IC1.6 36.68,8.08 v37.6,9 39.48,7.12 R13.2
  Top 0.406: 21.1,11.4 22.1,10.4 v22.9,10.4 | v37.6,9 37.8,9 C23.2 40.74,10.32 C22.2 | R13.2 40.42,5.2 43.8,5.2 44.7,4.3 44.7,1.8 45.1,1.4 46.15,1.4 47.02,2.27 47.02,3.02 47.23,3.23 47.24,3.23 C26.2
  Top 0.508: C3.2 28.97,17.31 L1.1
  Top 0.61: J4.2 21.1,11.4 23,11.4 24.2,12.6 24.2,15.3 26.21,17.31 C3.2
  Bottom 0.406: v22.9,10.4 23.3,10.4 25.6,8.1 36.7,8.1 v37.6,9
3.3V_SBW
  Top 0.61: J3.4 20.19,7.62 J4.3
3.3V_USB
  Top 0.203: U2.11 6.02,7.41 5.51,6.9 4.44,6.9 4.29,6.75 4.29,5.68 U2.3
  Top 0.254: C19.2 12.3,13.74 R28.2 15,13.72 R27.2
  Top 0.305: 8.3,16.47 8.3,22.66 LED2.A LED1.A
  Top 0.406: U2.10 U2.11 6.02,15.22 C18.2 8.3,16.47 C19.2
  Top 0.61: C18.2 15.11,8.63 J4.1
5V_USB  (via drill 0.35)
  Top 0.406: 7.8,40.9 7.09,40.19 USB1.P$1 5.51,40.1 4.78,40.1 4.32,39.64 4.32,30.08 v5,29.4 | U2.12 5.39,15.7 C17.2 5.26,17.01 5.27,17.01 5.84,17.58 5.84,20.76 v5.7,20.9
  Top 0.61: 7.8,40.9 9.48,42.58 M1.D M2.D
  Bottom 0.406: v5,29.4 5,21.6 v5.7,20.9
A_3.3V  (via drill 0.35)  (2 unrouted)
  Top 0.254: v38.4,34.6 34.7,34.6 v34.5,34.4
  Top 0.305: 38.4,44.4 37.4,44.4 v36.7,43.7 | 38.4,41.5 38.6,41.3 v40.6,41.3 | 59,20.13 U4.4 56.45,20.13 C20.2 | 59,20.13 U4.3 | U5.3 50.36,8.08 55.57,8.08 C16.2 | 59,20.13 59,3.6 57.7,2.3 54.4,2.3 53.8,2.9 v53.8,6.3
  Top 0.406: v38.4,34.6 38.4,41.5 38.4,44.4 38.4,46.9 v41.8,50.3 | v41.3,14.1 36.76,14.1 34.19,16.67 34.19,16.68 33.98,16.89 33.97,16.89 C6.2 | C14.2 55.68,3.9 55.78,4 C15.2 55.82,5.92 | C16.2 55.82,5.92 | v53.8,6.3 54.18,5.92 55.82,5.92
  Top 0.508: L1.2 32.69,18.17 | 32.69,18.17 C6.2 | 32.69,18.17 34.4,19.88 34.4,24.5 32.7,26.2 v32.7,27.6
  Bottom 0.203: U7.8 U7.7
  Bottom 0.254: v34.5,34.4 34.32,34.58 U7.8
  Bottom 0.305: v36.7,43.7 36.72,43.68 U8.8 | v40.6,41.3 39.77,40.47 C28.2 | v41.8,50.3 40.77,50.3 U6.1
  Bottom 0.406: v32.7,27.6 33.86,28.76 33.86,28.88 35.18,30.2 36.8,30.2 38.5,31.9 38.5,34.5 v38.4,34.6 | C27.2 40.01,51.13 U6.1 | v41.3,14.1 45.76,14.1 46.7,15.03 50.87,15.03 53.8,12.1 v53.8,6.3
AIN_N  (via drill 0.35)
  Top 0.305: C9.2 51.32,12.9 v51.2,12.9 49.67,11.37 U5.9 | C8.2 52.21,10.11 v51.9,9.8 51.17,9.8 50.9,10.08 50.36,10.08 U5.7 | C11.2 46.28,13.7 v46.4,13.7 46.4,13.22 47.52,12.1 47.52,11.41 U5.13 | U5.11 48.6,11.41 48.6,12.67 49.3,13.37 v49.3,14.3 49.3,15.54 C10.2 49.07,15.93 48.1,16.9 39.9,16.9 37.8,19 37.8,27.9 39.9,30 44.4,30 46.84,32.44 46.84,54.84 48,56 48,57.52 47.88,57.64 47.88,60.6 48,60.72 48,61.7 47.4,62.3 39.78,62.3 R1.1 R2.2 33.68,65.33 32.05,65.33 30.81,66.57 J7.2
  Bottom 0.305: v51.9,9.8 51.2,10.5 v51.2,12.9 49.8,14.3 v49.3,14.3 47,14.3 v46.4,13.7
AINP_0  (1 unrouted)
  Top 0.305: R5.1 48.73,54.99 R4.1 48.88,54.33 50.51,52.7 50.51,46.19 47.69,43.38 47.69,36.49 47.3,36.1 47.3,32 44.7,29.4 40.2,29.4 38.6,27.8 38.6,19.6 40.5,17.7 49.6,17.7 51.41,15.89 C9.1 49.06,12.48 U5.10
AINP_1  (1 unrouted)
  Top 0.305: R8.1 R10.1 48.2,35.66 48.2,31.7 45,28.5 40.3,28.5 39.45,27.66 39.45,20.55 41.2,18.8 50,18.8 53.5,15.3 53.5,11.74 C8.1 52.38,10.62 U5.8
AINP_2
  Top 0.305: R3.1 24.83,54.22 | 24.83,54.22 R30.1 27.6,51.45 27.6,30.3 28.7,29.2 35.3,29.2 36.8,27.7 36.8,18.8 39.4,16.2 47.6,16.2 47.77,16.03 C10.1 48.02,15.52 48.02,11.41 U5.12 | J8.2 23.01,54.22 24.83,54.22
AINP_3
  Top 0.203: 25.12,36.96 R7.1
  Top 0.305: U5.14 47.02,11.41 47.02,11.96 46.84,12.13 46.01,12.13 C11.1 44.07,13.73 42.5,15.3 38.4,15.3 35.7,18 35.7,27.2 34.3,28.6 27.7,28.6 26.5,29.8 26.5,34.88 R7.1 24.77,39.9 R6.1 24.83,39.96 J10.2
  Bottom 0.305: 24.83,39.96 R6.1
AMP_I
  Bottom 0.203: J2.2.1 40.81,36.01 42.93,38.13 42.93,48.17 42.22,48.88 U6.2
AMP_V+
  Bottom 0.203: R15.2 36.5,40.72 R18.1 35.82,38.4 U7.4
AMP_V-
  Bottom 0.203: R16.2 34.38,40.36 R17.1 35.32,38.08 U7.3
AMP_VB  (1 unrouted)
  Bottom 0.305: Q1.6 31.3,49.94 31.3,53.3 32.2,54.2 32.2,58.2 34,60 34,63.3
AMP_VDD  (1 unrouted)
  Bottom 0.305: Q1.2 32.5,61.3 32.5,64
AMP_VREF  (1 unrouted)
  Bottom 0.305: Q1.4 31.4,55.12 31.4,58.7 33.2,60.5 33.2,63.7
AMP_VSS  (1 unrouted)
  Bottom 0.305: Q1.9 29.44,40.98 27.81,42.6 27.81,45.94 28.38,46.51 28.41,46.51 29.02,47.12 30.5,47.12 31.8,48.41 31.8,53 32.8,54 32.8,57.7 34.6,59.5 34.6,62
AMPOUT  (1 unrouted)
  Bottom 0.203: R17.2 34.32,37.78 U7.1 | U7.6 35.32,34.28 C32.1 36.13,34.93 36.22,35.02 36.22,36.32 37.2,37.3 39.81,37.3 41.87,39.36 J3.2.1
BUF_OUT  (via drill 0.35)
  Top 0.254: Q1.19 43.18,48.08 v42.2,47.1
  Bottom 0.254: v42.2,47.1 42.23,47.07 J3.1.1
  Bottom 0.305: Q1.19 42.48,50.28 42.48,53.73 41.1,55.11 41.1,59.9
BUF_VB  (1 unrouted)
  Bottom 0.305: Q1.21 41.9,55.94 41.9,65
BUF_VDD  (1 unrouted)
  Bottom 0.305: Q1.22 42.8,57.58 42.8,65 42.7,65.1
BUF_VIN
  Bottom 0.203: U8.4 40.75,42.18 | 40.75,42.18 J3.2.2 | J3.1.2 42.23,43.66 40.75,42.18
BUF_VO  (via drill 0.35)  (2 unrouted)
  Top 0.254: v35.4,45.6 35.4,52.3 v35.6,52.5
  Bottom 0.203: U8.1 40.36,43.58 40.72,43.58 40.86,43.44 40.86,42.92 40.72,42.78 40.36,42.78 U8.3
  Bottom 0.254: U8.6 38.09,42.75 37.69,42.75 37.4,43.04 36.43,43.04 35.4,44.07 v35.4,45.6 | v35.6,52.5 35.6,52.9 35,53.5 35,55.1
BUF_VSS  (1 unrouted)
  Bottom 0.305: Q1.14 44.68,35.9 46.31,37.52 46.31,61.18 45.74,61.74 44.66,61.74 43.5,62.9 43.5,64
CSB_B  (via drill 0.35)
  Top 0.203: U5.31 49.06,5.54 v49.8,4.8 | v31.6,14.27 31.95,13.91 32.49,13.91 33.09,13.31 IC1.15
  Bottom 0.203: v49.8,4.8 49.8,4 49.3,3.5 46.2,3.5 41.7,8 41.7,11.5 40.8,12.4 39.9,12.4 39.2,13.1 37.93,13.1 37.56,12.73 37.04,12.73 36.67,13.1 36.67,13.13 35.3,14.5 31.83,14.5 v31.6,14.27
D+  (via drill 0.35)
  Top 0.203: USB1.P$3 5.8,38.69 6.38,38.69 6.97,38.1 9.2,38.1 C4.2 10.26,36.74 v11.5,35.5 | v8.5,6.2 7.8,5.5 U2.8
  Bottom 0.203: v11.5,35.5 11.5,11.3 8.5,8.3 v8.5,6.2
D-  (via drill 0.35)
  Top 0.203: USB1.P$2 C2.2 11.98,37.73 12.01,37.73 12.4,37.35 12.4,34.8 11.2,34.8 v10.7,34.3 | v9.2,12 7.73,10.54 U2.9
  Bottom 0.203: v10.7,34.3 10.7,13.5 v9.2,12
DIN_B  (via drill 0.35)
  Top 0.203: U5.32 50.5,5.43 v50.5,4.2 | v35.65,13.25 34.84,13.25 IC1.13
  Bottom 0.203: v50.5,4.2 50.16,3.86 50.16,3.85 49.45,3.14 45.76,3.14 41.3,7.6 41.3,11 40.4,11.9 39.5,11.9 38.9,12.5 37.83,12.5 37.71,12.38 36.53,12.38 v35.65,13.25
DOUT_B  (via drill 0.35)
  Top 0.203: U5.30 48.56,4.45 v48.81,4.2 | v37.3,13.37 35.52,11.58 IC1.12
  Bottom 0.203: v48.81,4.2 48.71,4.3 45.9,4.3 42.2,8 42.2,11.7 41,12.9 40,12.9 38.4,14.5 37.6,14.5 37.3,14.2 v37.3,13.37
GND  (140 unrouted)
LIM_HI  (via drill 0.35)  (1 unrouted)
  Top 0.254: v33.61,42.9 33.61,51.41 v34.5,52.3
  Bottom 0.254: D2.C 33.13,42.42 v33.61,42.9 | v34.5,52.3 34.5,55.2
LIM_LO  (via drill 0.35)  (1 unrouted)
  Top 0.254: v32.7,43.2 32.7,51.6 v33.4,52.3
  Bottom 0.254: D1.A 32.57,43.2 v32.7,43.2 | v33.4,52.3 33.8,52.7 33.8,55.3
MEMS_IN
  Bottom 0.254: J1.1.2 33.13,30.48 32.41,29.75 25.55,29.75 19.5,35.8 19.5,48.7 17.62,50.58 13.42,50.58 10.8,53.2 10.8,57.2
MEMS_IN_R
  Bottom 0.203: Q1.12 31.55,32.84 J1.2.2 31.97,30.51 J1.1.1 31.8,30.48
MEMS_IN_S
  Bottom 0.203: C32.2 33.52,32.17 J1.2.1
  Bottom 0.305: D2.A 32.96,41.49 32.7,41.49 32.66,41.53 D1.C 31.55,38.75 32.43,37.88 33.31,37.88 33.48,37.7 33.48,37.02 33.6,36.9 33.6,36.14 L2.2
  Bottom 0.406: L2.2 32.48,33.21 32.68,33.02 32.68,33.01 J1.2.1
MEMS_OUT
  Bottom 0.203: Q1.13 42.5,32.84 J2.1.1 42.08,34.15 J2.2.2
MEMS_VB  (1 unrouted)
  Bottom 0.254: Q1.11 31.12,37.06 31.12,41.1 30.97,41.24 30.97,42.48 32.2,43.71 32.2,45.14 32.3,45.23 32.3,52.59 33.3,53.6 33.3,57.3 35.13,59.13 35.13,62
  Bottom 0.305: Q1.11 30.84,35.38 L2.1
MEMS_VO  (via drill 0.35)  (1 unrouted)
  Top 0.254: v39.7,36.4 39.7,38.6 41.5,40.4 41.5,47.9 42.8,49.2 42.8,50.4 40,53.2 v40,53.5
  Bottom 0.254: J2.1.2 40.78,33.02 40.18,33.61 40.18,35.92 v39.7,36.4 | v40,53.5 40,55.2 40.6,55.8 40.6,57.8
MSP_RX  (via drill 0.35)
  Top 0.203: v5.2,2.1 3.19,4.11 3.17,4.11 2.85,4.43 U2.1 | v15,10.8 15.56,10.8 R27.1 20.42,12.42 J5.1 | IC1.24 28.5,12.6 v25.6,12.6
  Bottom 0.203: v5.2,2.1 8.31,5.21 8.91,5.21 9.8,6.1 9.8,8.1 12.5,10.8 v15,10.8 | v25.6,12.6 21,12.6 J5.1
MSP_TX  (via drill 0.35)
  Top 0.203: U2.4 4.75,3.85 v5.4,3.2 | v13.3,12.5 13.36,12.44 R28.1 16.04,12.44 16.62,13.02 18.48,13.02 J5.2 | v25.4,14.5 26,13.9 28.5,13.9 29.09,13.31 IC1.23
  Bottom 0.203: v5.4,3.2 7.77,5.57 8.76,5.57 9.3,6.11 9.3,8.5 v13.3,12.5 | J5.2 24.56,15.34 v25.4,14.5
N$1
  Top 0.254: C25.2 43.37,8.37 44.12,9.12 U5.20
N$2
  Top 0.254: C25.1 42.92,9.62 U5.19
N$3
  Bottom 0.203: C31.2 33.38,45.32 R14.1 36.38,42.32 R15.1
N$4  (1 unrouted)
N$6
  Top 0.305: U4.1 62.15,18.23 C12.2
N$7
  Bottom 0.203: C30.2 32.68,49.96 32.68,44.72 R14.2 34.78,42.62 R16.1
N$10
  Top 0.254: U5.26 46.49,6.3 46.49,5.79 45.93,5.23 C34.2
N$12
  Bottom 0.203: U6.7 36.91,49.05 C30.1
N$13
  Bottom 0.203: C31.1 35.76,47.07 36.25,47.56 36.25,47.79 36.4,47.94 36.63,47.94 U6.6
N$15  (1 unrouted)
N$20
  Top 0.254: R12.2 LED2.C
N$21
  Top 0.254: R9.2 5.01,27.84 LED1.C
N_REF  (via drill 0.35)
  Top 0.305: J8.3 21.37,54.1 20.12,55.34 20.12,58.92 20.85,59.65 22.45,59.65 27.49,64.69 J7.1 28.27,66.57 35.02,59.81 45.74,59.81 46.31,60.38 46.31,60.61 v47.2,61.5
  Bottom 0.305: J10.3 21.43,53.26 J8.3 | v47.2,61.5 47.8,60.9 53.4,60.9 54.9,59.4 54.9,55.34 J9.3 53.27,43.35 J11.3
P3.6  (via drill 1.02 pad 1.78)
  Top 0.203: IC1.36 25.09,3.5 v24.8,3.5
RDYB_B  (via drill 0.35)
  Top 0.203: U5.1 50.31,6.12 51.13,5.3 51.13,2.73 v50.7,2.3 | v29.9,5.6 29.42,6.08 IC1.35
  Bottom 0.203: v50.7,2.3 49.39,2.3 49.38,2.29 33.21,2.29 v29.9,5.6
RSTB_B  (via drill 0.35)
  Top 0.203: U5.27 46.97,6.27 46.97,5.73 46.8,5.57 v46.8,5 | v30.4,14.4 31.24,13.56 31.85,13.56 32.09,13.31 IC1.17
  Bottom 0.203: v46.8,5 45.9,5 42.6,8.3 42.6,12.1 41.3,13.4 40.1,13.4 38.6,14.9 30.9,14.9 v30.4,14.4
RX#1
  Top 0.203: U2.14 3.94,10.71 3.94,11.78 3.23,12.49 R12.1
SBW_RST
  Top 0.305: R13.1 39.79,4.13 C24.2 | IC1.5 37.62,7.58 38.62,6.58 38.62,5.51 39.48,4.66 R13.1 | J3.2 21.33,1.4 36.44,1.4 R13.1
SBW_TEST
  Top 0.305: J3.3 23.17,2.1 36.1,2.1 37.4,3.4 37.4,6.08 36.44,7.04 35.56,7.04 IC1.4
SCLK_B  (via drill 0.35)
  Top 0.203: U5.2 50.33,7.6 51.5,7.6 51.8,7.3 v52.9,7.3 | v34.2,13.84 33.92,13.56 33.84,13.56 33.59,13.31 IC1.14
  Bottom 0.203: v52.9,7.3 51.13,5.53 51.13,3.94 49.98,2.79 45.61,2.79 40.94,7.45 40.94,10.6 40,11.54 39.35,11.54 39,11.9 36.11,11.9 35.02,12.99 35.02,13.02 v34.2,13.84
TCTRL_0  (via drill 0.35, 1.02 pad 1.78)  (1 unrouted)
  Top 0.254: v13.2,26.9 12.88,27.22 12.88,39.32 11.08,41.12 M1.G 10.3,44.49 10.3,45.53 11.08,46.3 M2.G 10.26,47.78 10.26,48.13 10.1,48.29 8.86,48.29 8.78,48.2 v7.6,48.2 | v31.8,10.1 33.09,8.81 IC1.46
  Bottom 0.254: v13.2,26.9 13.2,20.2 15.5,17.9 24,17.9 v31.8,10.1
TX#1  (via drill 0.35)
  Top 0.305: R9.1 2.4,26.99 v2.4,14.7 | v6.8,7.9 6.8,6.79 6.78,6.78 6.78,5.63 U2.7
  Bottom 0.305: v2.4,14.7 2.4,12.3 v6.8,7.9
VFB_0  (via drill 0.35, 0.6)
  Top 0.254: IC1.45 32.59,6.51 v30,9.1 | M1.S 11.08,44.92 11.61,44.39 11.7,44.39 11.86,44.23 11.86,44.14 v12.2,43.8
  Top 0.61: M2.S 12.14,48.26 12.7,47.7 12.7,46.6 12.7,46 11.71,45.01 M1.S
  Top 0.813: 12.7,46.6 21.2,46.6 R23.1 | R23.1 21.57,45.57 19,43 19,34.32 R20.2 22.48,27.42 23.7,26.2 23.8,26.3 v25,26.3 | R22.2 54.7,46.63 54.7,31.4 52.22,28.92 R25.1 46.86,26.8 v41.77,26.8 | R23.1 19.4,49.14 19.4,59.8 22.23,62.63 R19.1 23.01,62.88 23.01,64.95 26.37,68.3 36.29,68.3 | 36.29,68.3 R26.2 | 36.29,68.3 48.3,68.3 51.4,65.21 R21.1
  Bottom 0.254: v30,9.1 26.26,12.84 26.26,14.57 23.73,17.1 14.9,17.1 12.3,19.7 12.3,34.2 12.88,34.78 12.88,43.12 v12.2,43.8
  Bottom 0.813: 34.99,27.8 R24.2 | v25,26.3 33.48,26.3 R24.2 | R24.2 36.75,26.09 41.07,26.09 v41.77,26.8